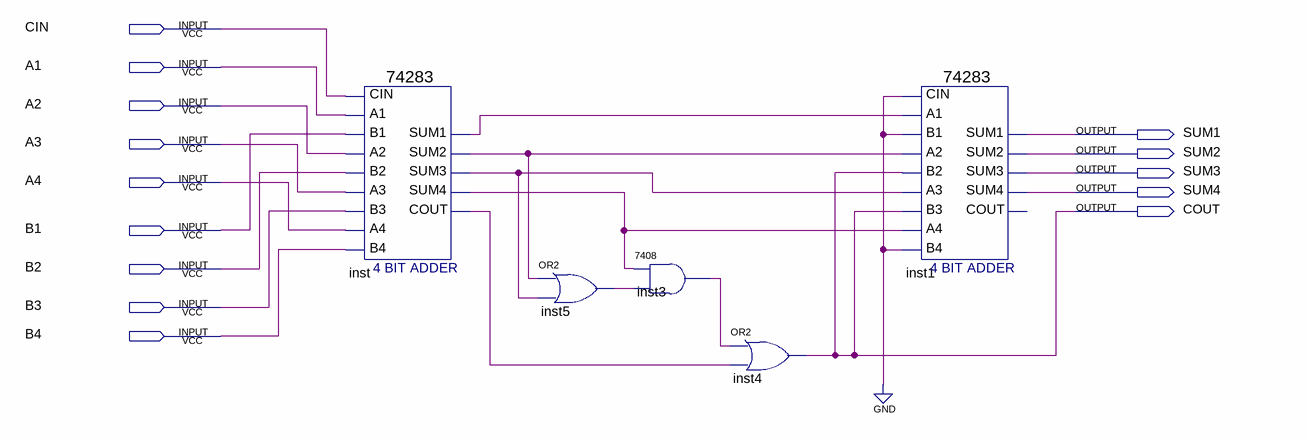
[diagram p0: schematic sheet]
// Quartus schematic BCDadder.bdf as structural Verilog: 5 symbols, 14 pins
module BCDadder (
  input  CIN,
  input  A1,
  input  A2,
  input  A3,
  input  A4,
  input  B1,
  input  B2,
  input  B3,
  input  B4,
  output SUM1,
  output SUM2,
  output SUM3,
  output SUM4,
  output COUT
);

  wire inst3_1, inst5_out, inst_cout, inst_sum1, inst_sum2, inst_sum3, inst_sum4;

  \74283  inst (
    .CIN(CIN), .A1(A1), .A2(A2), .B2(B2), .A3(A3), .A4(A4), .B4(B4), .B1(B1), .B3(B3), .SUM4(inst_sum4),
    .COUT(inst_cout), .SUM1(inst_sum1), .SUM2(inst_sum2), .SUM3(inst_sum3));
  or inst5 (inst5_out, inst_sum2, inst_sum3);
  \7408  inst3 (.\3 (inst5_out), .\2 (inst_sum4), .\1 (inst3_1));
  or inst4 (COUT, inst3_1, inst_cout);
  \74283  inst1 (
    .CIN(1'b0), .A1(inst_sum1), .A2(inst_sum2), .B2(COUT), .A3(inst_sum3), .A4(inst_sum4), .B4(1'b0),
    .B1(1'b0), .B3(COUT), .SUM4(SUM4), .SUM1(SUM1), .SUM2(SUM2), .SUM3(SUM3));  // open: COUT
endmodule
